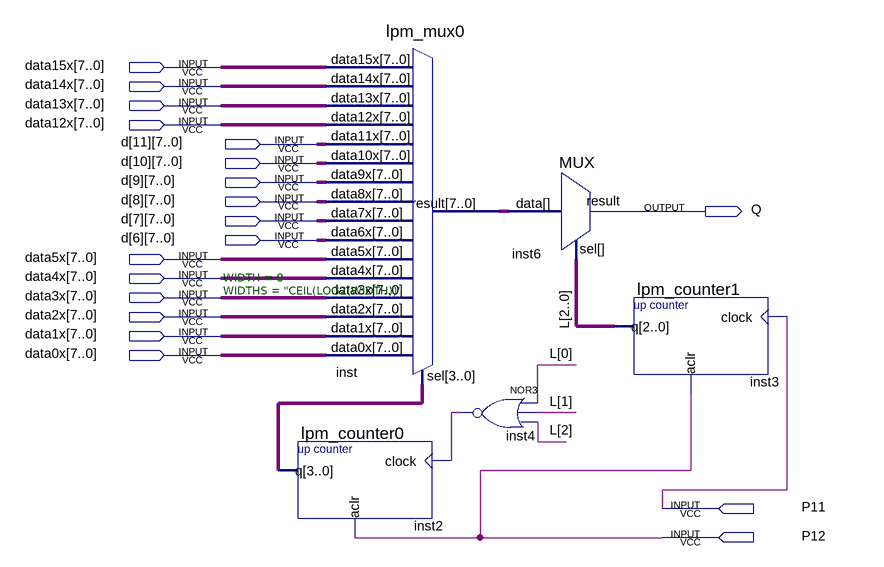
[diagram p0: schematic sheet]
// Quartus schematic DSPL.bdf as structural Verilog: 5 symbols, 19 pins
module DSPL (
  input  [7:0] data15x,
  input  [7:0] data14x,
  input  [7:0] data13x,
  input  [7:0] data12x,
  input  [7:0] d_11,
  input  [7:0] d_10,
  input  [7:0] d_9,
  input  [7:0] d_8,
  input  [7:0] d_7,
  input  [7:0] d_6,
  input  [7:0] data5x,
  input  [7:0] data4x,
  input  [7:0] data3x,
  input  [7:0] data2x,
  input  [7:0] data1x,
  input  [7:0] data0x,
  input  P11,
  input  P12,
  output Q
);

  wire inst4_out;
  wire [2:0] L;
  wire [3:0] inst2_q;
  wire [7:0] inst_result;

  lpm_mux0 inst (
    .data15x(data15x), .data14x(data14x), .data13x(data13x), .data12x(data12x), .data11x(d_11),
    .data10x(d_10), .data9x(d_9), .data8x(d_8), .data7x(d_7), .data6x(d_6), .data5x(data5x), .data4x(data4x),
    .data3x(data3x), .data2x(data2x), .data1x(data1x), .data0x(data0x), .sel(inst2_q), .result(inst_result));
  lpm_counter0 inst2 (.clock(inst4_out), .aclr(P12), .q(inst2_q));
  nor inst4 (inst4_out, L[0], L[1], L[2]);
  MUX #(.WIDTH(8), .WIDTHS("CEIL(LOG2(WIDTH))")) inst6 (.data(inst_result), .sel(L), .result(Q));
  lpm_counter1 inst3 (.clock(P11), .aclr(P12), .q(L));
endmodule
